# EAGLE design ReSpeaker_OPA548_V03 (EAGLE 9.2.2)
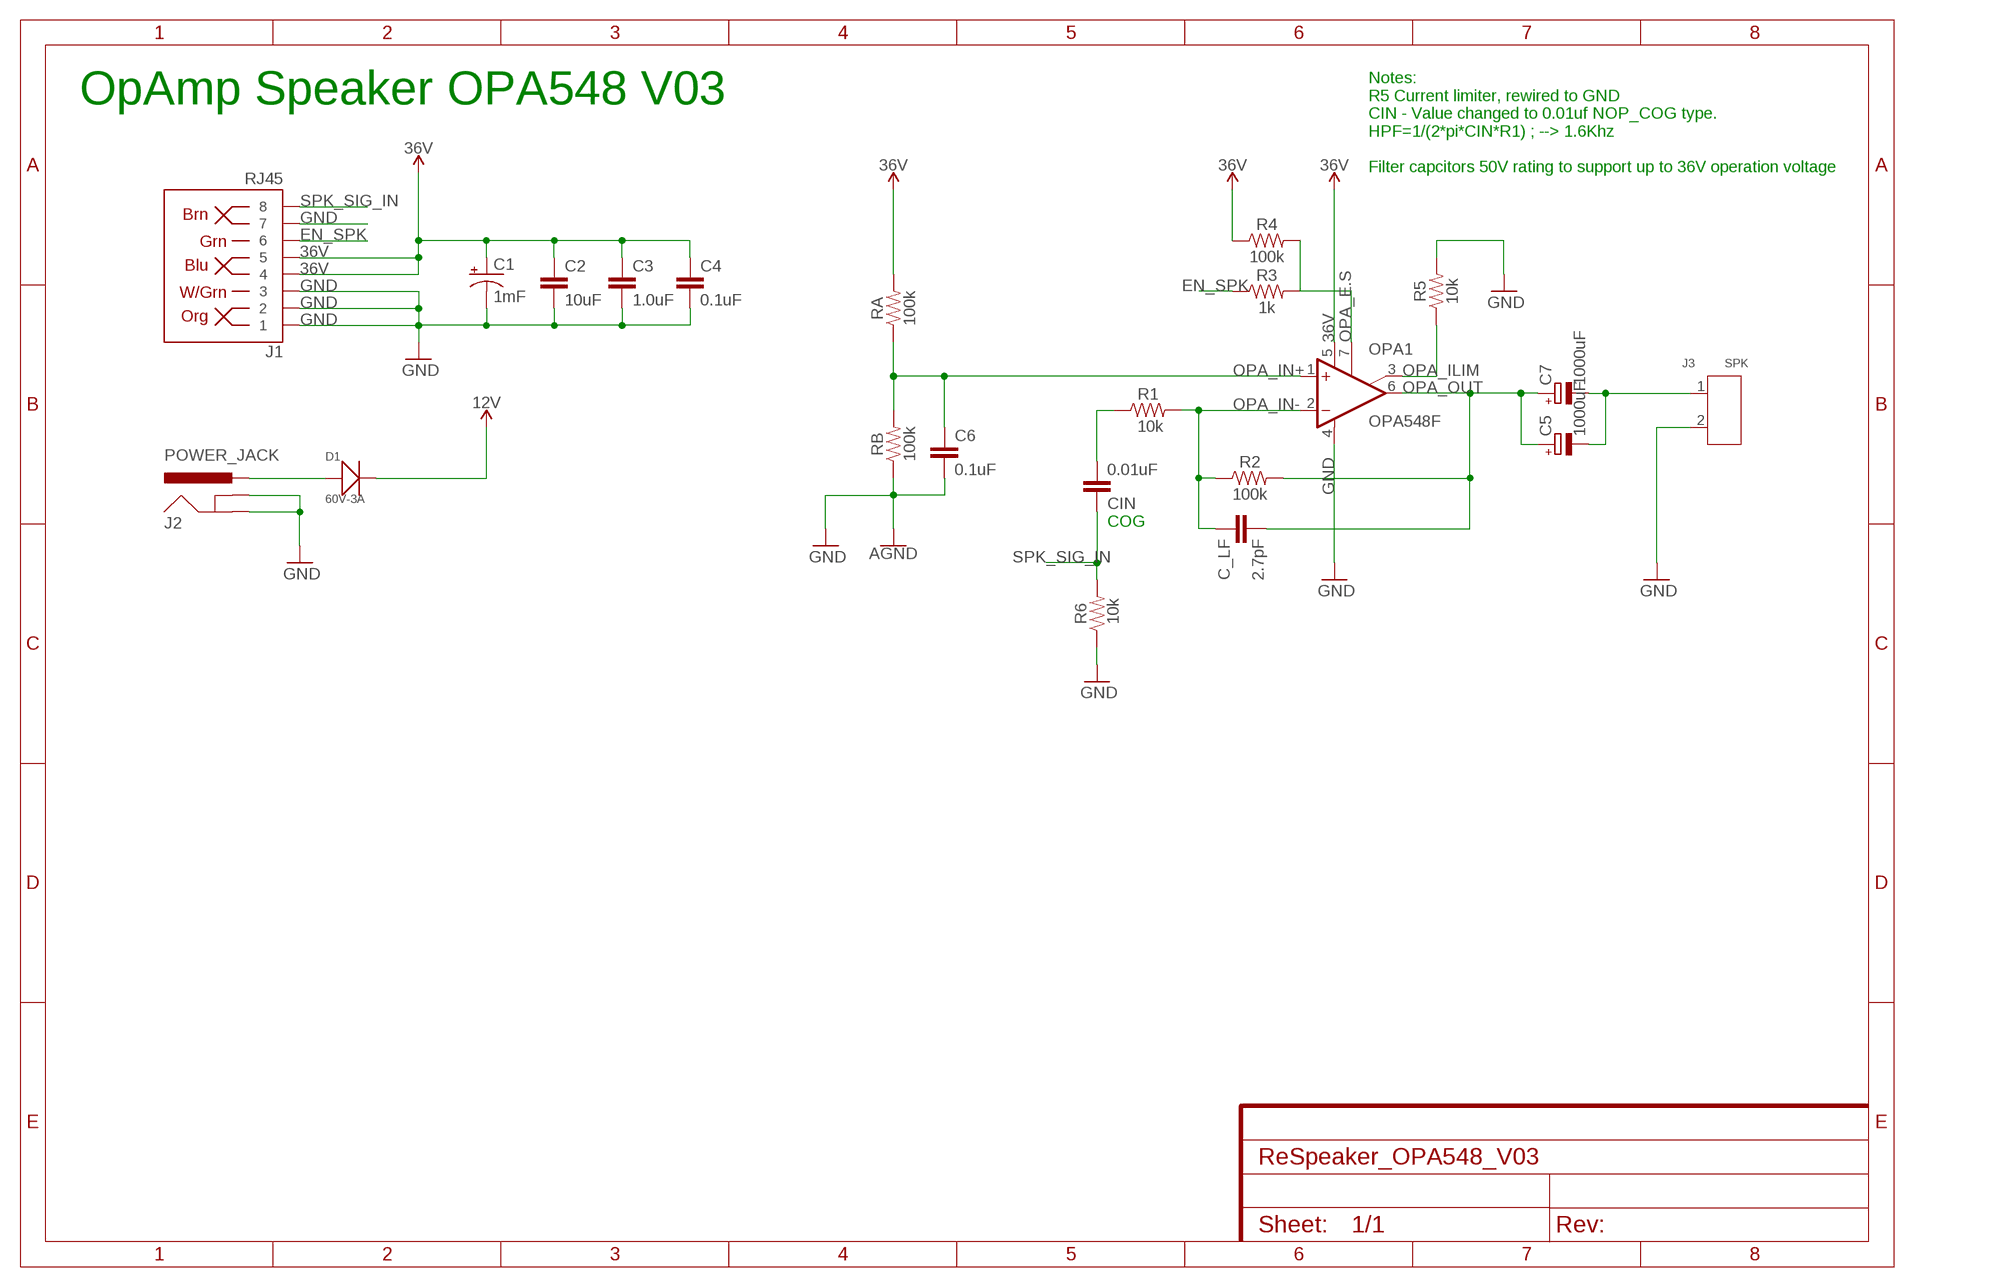
[diagram p0: schematic, sheet 1]

## Parts
C1  1mF  1000UF-RADIAL-5MM-25V-20%  [CPOL-RADIAL-5MM-10MM]
C2  10uF  10UF-0805-10V-10%  [0805]
C3  1.0uF  1.0UF-0805-25V-10%  [0805]
C4  0.1uF  1.0UF-0805-25V-10%  [0805]
C5  1000uF  CPOL-EUE7.5-16  [E7,5-16]
C6  0.1uF  1.0UF-0805-25V-10%  [0805]
C7  1000uF  CPOL-EUE7.5-16  [E7,5-16]
C_LF  2.7pF  1.0UF-0805-25V-10%  [0805]
CIN  0.01uF  1.0UF-0805-25V-10%  [0805]
D1  60V-3A  SMD-DIODE-SCHOTTKY-40V-3A(DO-214AB)  [DO-214AB]
J1  RJ45  RJ45-8  [RJ45-8]
J2  POWER_JACK  [POWER_JACK_PTH]
J3  SPK  SCREW-TERMINAL-GREEN(2P-5.0)  [H2-5.0-10.5X8.0MM]
OPA1  OPA548F  [DD-7]
R1  10k  RESISTOR0805  [0805]
R2  100k  RESISTOR0805  [0805]
R3  1k  RESISTOR0805  [0805]
R4  100k  RESISTOR0805  [0805]
R5  10k  RESISTOR0805  [0805]
R6  10k  RESISTOR0805  [0805]
RA  100k  RESISTOR0805  [0805]
RB  100k  RESISTOR0805  [0805]

## Nets
36V: C1.+ C2.1 C3.1 C4.1 D1.2(-) J1.4 J1.5 OPA1.5(V+) R4.1 RA.2 ; supply symbol labelled 12V
EN_SPK: J1.6 R3.1
GND: C1.- C2.2 C3.2 C4.2 C6.2 J1.1 J1.2 J1.3 J1.7 J2.GND J2.GNDBREAK J3.2 OPA1.4(V-) R5.2 R6.1 RB.1 ; supply symbol labelled AGND
N$1: D1.1(+) J2.PWR
N$2: C5.- C7.- J3.1
N$3: CIN.2 R1.1
OPA_E.S: OPA1.7(E/S) R3.2 R4.2
OPA_ILIM: OPA1.3(ILIM) R5.1
OPA_IN+: C6.1 OPA1.1(+IN) RA.1 RB.2
OPA_IN-: C_LF.1 OPA1.2(-IN) R1.2 R2.1
OPA_OUT: C5.+ C7.+ C_LF.2 OPA1.6(OUT) R2.2
SPK_SIG_IN: CIN.1 J1.8 R6.2

## Notes on the sheet
- OpAmp Speaker OPA548 V03
- Notes:
  R5 Current limiter, rewired to GND
  CIN - Value changed to 0.01uf NOP_COG type.
  HPF=1/(2*pi*CIN*R1) ; --> 1.6Khz
  
  Filter capcitors 50V rating to support up to 36V operation voltage
- COG

## Library data of the parts
C1 = SparkFun-Capacitors:1000UF: 1,000µF/1mF ceramic capacitors A capacitor is a passive two-terminal electrical component used to store electrical energy temporarily in an electric field. CAP-08070; PROD_ID: CAP-09538
C2 = SparkFun-Capacitors:10UF: 10.0µF ceramic capacitors A capacitor is a passive two-terminal electrical component used to store electrical energy temporarily in an electric field.; PROD_ID: CAP-11330
C3 = SparkFun-Capacitors:1.0UF: 1µF ceramic capacitors A capacitor is a passive two-terminal electrical component used to store electrical energy temporarily in an electric field.; PROD_ID: CAP-08064
C4 C6 C_LF CIN = SparkFun-Capacitors:1.0UF: 1µF ceramic capacitors A capacitor is a passive two-terminal electrical component used to store electrical energy temporarily in an electric field.; PROD_ID: CAP-08064; VALUE: 1.0uF
C5 C7 = rcl:CPOL-EU: POLARIZED CAPACITOR, European symbol; SPICEPREFIX: C
D1 = Seeed-OPL-Diode:SMD-DIODE-SCHOTTKY-40V-3A(DO-214AB): 304020018; MPN: SS34-E3/57T; VALUE: 40V-3A
J1 = SparkFun-Connectors:RJ45-8: RJ45 Jack - 8 pin Simple RJ45, 8-pin connection. Commonly used for Cat5, Cat5e, and Cat6 Ethernet cables. Here is the connector we sell at SparkFun: RJ45 8-Pin Connector <https://www.sparkfun.com/products/643> (PRT-00643) Datasheet <https://cdn.sparkfun.com/datasheets/Prototyping/04908.pdf> It is used on this SparkFun product: SparkFun RJ45 Breakout <https://www.sparkfun.com/products/716> (BOB-00716) Note, you may also be interested in the "MAGJACK" version of this. It is basically a RJ45 connector, but also has some status LEDs built into the connector housing. You can check that out in this library at the device named "MAGJACK.dev" and see these products online: RJ45 Ethernet MagJack-Compatible <https://www.sparkfun.com/products/8534> (PRT-08534) SparkFun RJ45 MagJack Breakout <https://www.sparkfun.com/products/13021> (BOB-13021); PROD_ID: CONN-08506; SF_ID: PRT-00643
J2 = SparkFun-Connectors:POWER_JACK: Power Jack Connector This is the standard 5.5mm barrel jack for power. The PTH is the most common, proven, reliable, footprint. The Slot footprint only works if the mill layer is transmitted to the PCB fab house so be warned. Here are the connectors we sell at SparkFun: DC Barrel Power Jack/Connector <https://www.sparkfun.com/products/119> (PRT-00119) DC Barrel Power Jack/Connector (SMD) <https://www.sparkfun.com/products/12748> (PRT-12748) DC Barrel Jack Adapter - Breadboard Compatible <https://www.sparkfun.com/products/10811> (PRT-10811) It is used on this SparkFun product (and many, many others): SparkFun RedBoard - Programmed with Arduino <https://www.sparkfun.com/products/12757> (DEV-12757) Also, if you need a mating power supply or connector, please check these out: Wall Adapter Power Supply - 9VDC 650mA <https://www.sparkfun.com/products/298> (TOL-00298) DC Barrel Jack Adapter - Male <https://www.sparkfun.com/products/10287> (PRT-10287); PROD_ID: CONN-08197
J3 = Seeed-OPL-Connector:SCREW-TERMINAL-GREEN(2P-5.0): 320110031; VALUE: GREEN-2P-5.0
OPA1 = burr-brown:OPA548: Operational Amplifier High-Voltage, High-Current; MPN: OPA548FKTWTG3; OC_FARNELL: 1234750; OC_NEWARK: 80K2676
R1-R6 RA RB = SparkFun-Resistors:RESISTOR: Generic Resistor Package

## Net classes
0 default: width 0.254 mm, drill 0.3 mm, clearance 0.254 mm
1 Power: width 0.305 mm, drill 0.3 mm, clearance 0.254 mm to class 0, clearance 0.254 mm

## Board
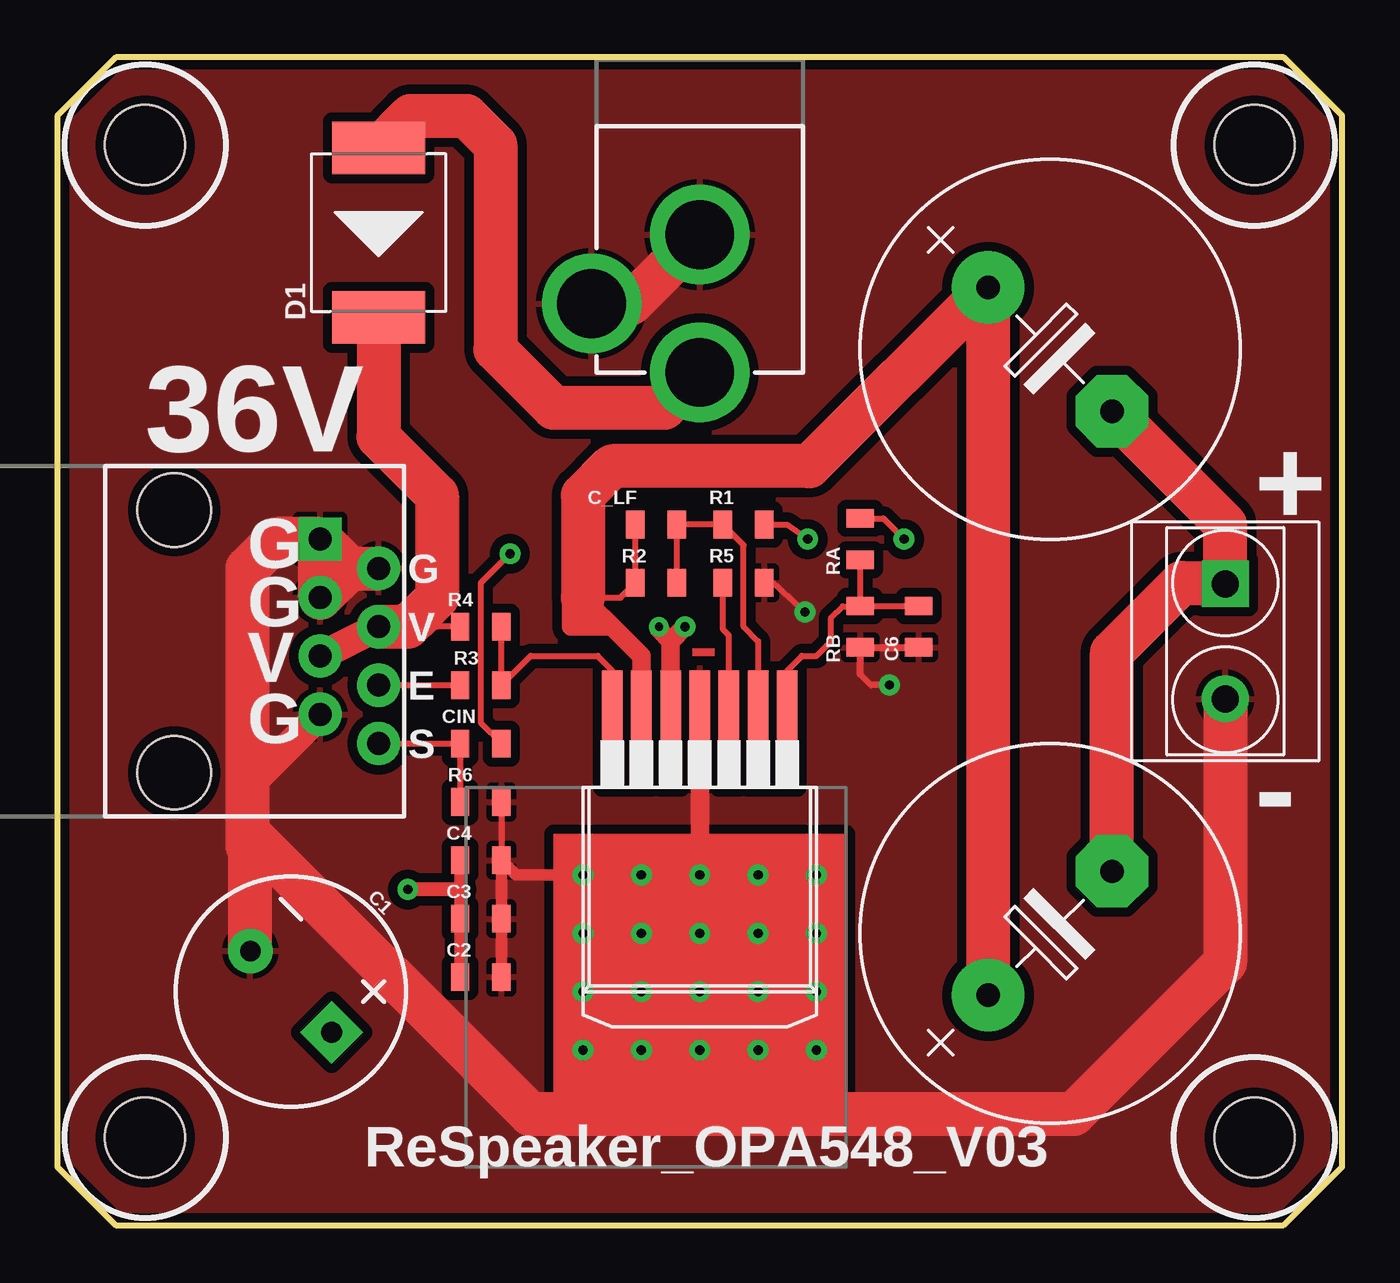
[diagram p1: board, top side]
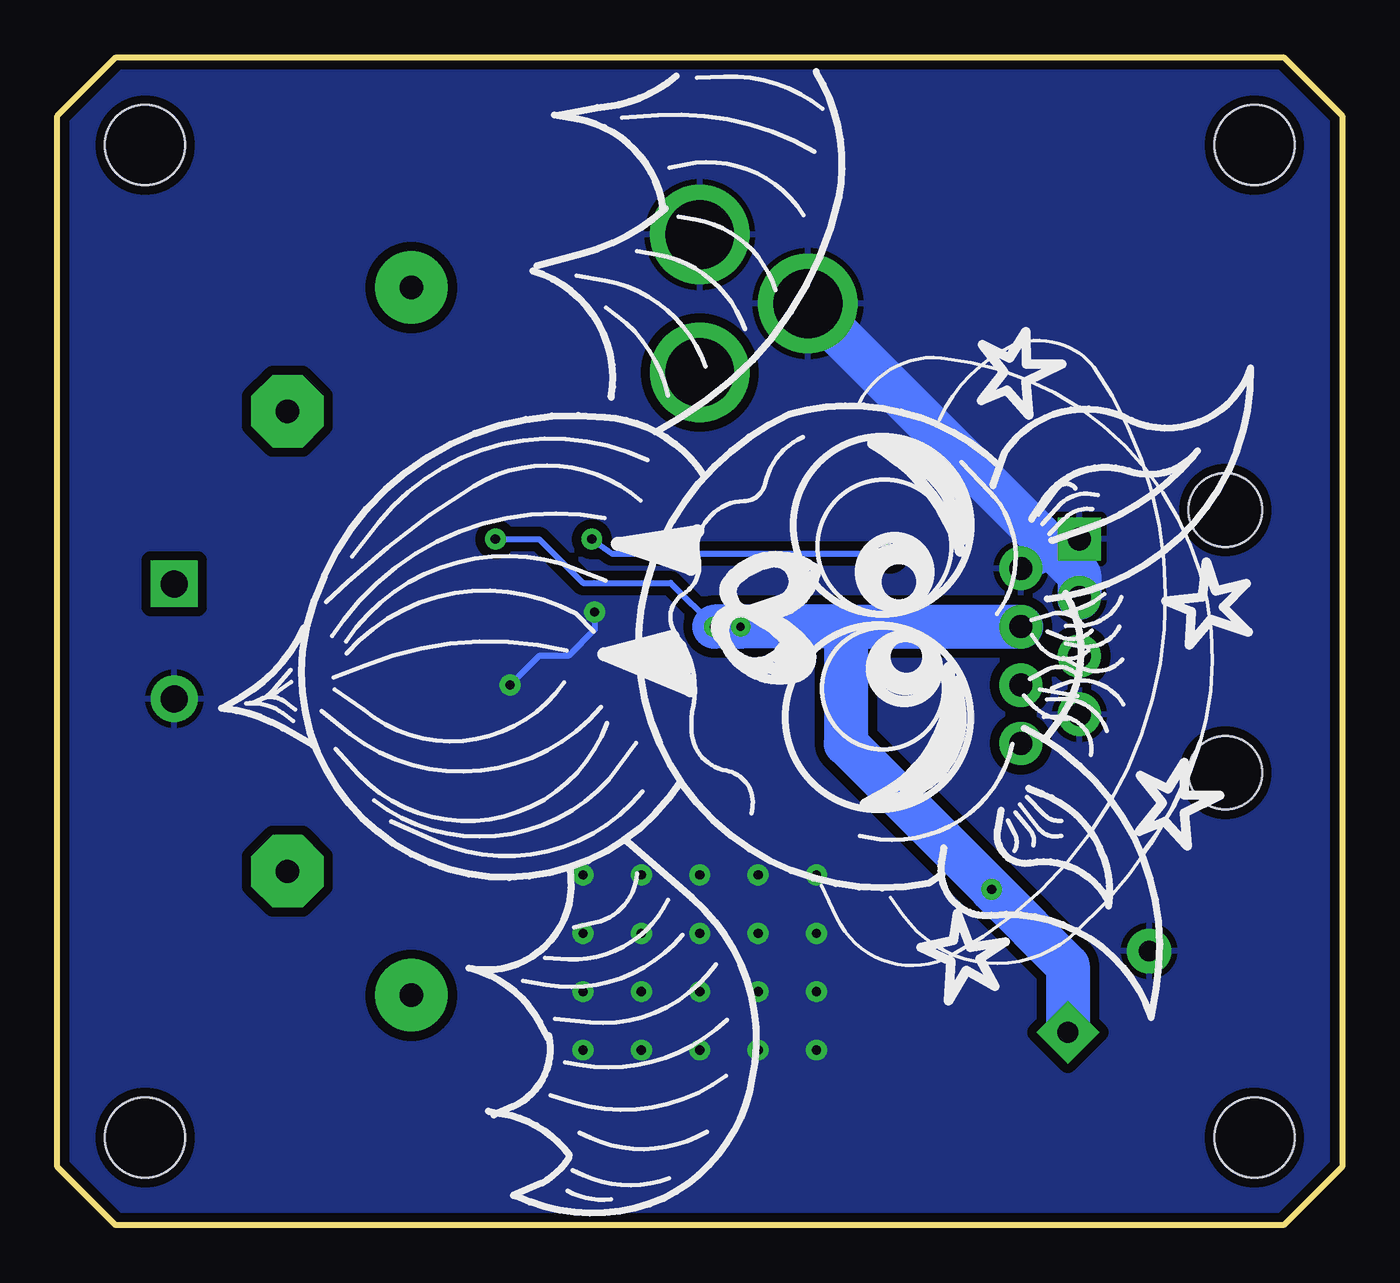
[diagram p2: board, bottom side, seen from below]

Size 55.88 x 50.8 mm. Coordinates in mm from the lower left corner, seen from the top.
Outline: 2.54,0 53.34,0 55.88,2.54 55.88,48.26 53.34,50.8 2.54,50.8 0,48.26 0,2.54 2.54,0
Copper layers (1*16): Top 0.035mm / dielectric 1.5mm / Bottom 0.035mm
Design rules "Modified-SparkFun-2-layer-STANDARD": minimum track width 10mil, minimum drill 10mil, track to track 10mil, track to pad 8mil, pad to pad 8mil, via to via 10mil, smd to smd 8mil, copper to edge 8mil, drill to drill 8mil, minimum pad ring 10mil, minimum via ring 10mil, stop-mask expansion 4mil, vias tented up to drill 25mil, thermal gap 10mil
Holes 3.5 mm at 3.81,46.99 52.07,46.99 52.07,3.81 3.81,3.81

### Footprints (pad centres in the part's own frame; a part is rotated, then mirrored left to right if it is on the bottom)
CPOL-RADIAL-5MM-10MM = drill 0.9 pad 1.93 square: + 2.5,0 | drill 0.9 pad 1.93: - -2.5,0
0805 = smd 0.8 x 1.2: 1 -0.9,0; 2 0.9,0
E7,5-16 = drill 1.016 pad 3.15: + -3.81,0 | drill 1.016 pad 3.15 octagon: - 3.81,0
DO-214AB = smd 2.286 x 4.064: 1 -3.683,0; 2 3.683,0
RJ45-8 = drill 1 pad 1.88 square: 1 -4.445,6.35 | drill 1 pad 1.88: 2 -3.175,8.89; 3 -1.905,6.35; 4 -0.635,8.89; 5 0.635,6.35; 6 1.905,8.89; 7 3.175,6.35; 8 4.445,8.89 | hole 3.2: -5.715,0; 5.715,0
POWER_JACK_PTH = drill 2.997 pad 4.318: GND 0,7.7; GNDBREAK 4.7,10.7; PWR 0,13.7
H2-5.0-10.5X8.0MM = drill 1.168 pad 2.032 square: 1 0,2.5 | drill 1.168 pad 2.032: 2 0,-2.5
DD-7 = smd 0.889 x 5.08: 1 -3.81,-6.985; 2 -2.54,-6.985; 3 -1.27,-6.985; 4 0,-6.985; 5 1.27,-6.985; 6 2.54,-6.985; 7 3.81,-6.985

### Placement (x,y rotation side)
C1  10.16,10.16 315 top
C2  18.41,10.79 0 top
C3  18.41,13.34 0 top
C4  18.41,15.88 0 top
C5  43.18,12.7 45 top
C6  37.47,26.04 270 top
C7  43.18,38.1 315 top
C_LF  26.04,30.48 180 top
CIN  18.41,20.95 0 top
D1  13.97,43.18 270 top
J1  5.08,25.4 270 top
J2  27.94,50.8 180 top
J3  50.8,25.4 0 top
OPA1  27.94,14.61 180 top
R1  29.84,30.48 180 top
R2  26.04,27.94 180 top
R3  18.41,23.5 0 top
R4  18.41,26.04 0 top
R5  29.84,27.94 0 top
R6  18.41,18.41 180 top
RA  34.92,29.84 90 top
RB  34.92,26.04 90 top

### Tracks (layer width: path | path; a pad name or v marks a point on that pad's centre or on a via)
36V  (via drill 0.35, 0.4)
  Top 0.254: R4.1 16.51,26.04 15.88,26.67 | RA.2 35.93,30.75 v36.83,29.84
  Top 0.508: C2.1 C3.1 17.52,14.61 C4.1
  Top 0.61: 17.52,14.61 v15.24,14.61
  Top 0.813: 26.67,25.4 v27.3,26.04 | 26.67,25.4 26.16,25.91 v26.16,26.04 | 26.67,25.4 OPA1.5
  Top 1.27: J1.5 J1.4
  Top 1.905: J1.4 15.24,26.04 15.88,26.67 16.51,27.3 16.51,31.75 13.97,34.29 D1.2
  Bottom 0.254: v36.83,29.84 34.92,29.84 33.02,27.94 29.21,27.94 v27.3,26.04
  Bottom 1.905: 21.59,26.04 J1.4 | 21.59,26.04 v26.16,26.04 v27.3,26.04 | 21.59,26.04 21.59,20.95 v15.24,14.61 11.93,11.29 C1.+
EN_SPK
  Top 0.254: J1.6 R3.1
GND  (via drill 0.4)
  Top 0.254: R5.2 31.11,27.94 v32.51,26.67 | v36.2,23.5 35.39,23.5 34.92,23.96 | R6.1 C4.2
  Top 0.305: 34.92,23.96 RB.1 C6.2
  Top 0.508: C2.2 C3.2 C4.2 19.95,15.24 v22.86,15.24
  Top 0.813: v27.94,15.24 OPA1.4
  Top 1.27: J1.7 8.26,19.05
  Top 1.905: 12.7,28.57 J1.2 | 12.7,28.57 J1.3 J1.1 | J1.1 12.7,28.57 | J1.1 9.53,29.84 8.26,28.57 8.26,19.05 8.26,16.51 8.39,16.37 | 27.94,4.83 44.2,4.83 50.8,11.43 J3.2 | 27.94,4.83 20.57,4.83 8.39,17.01 8.39,16.37 | C1.- 8.39,16.37 | J2.GNDBREAK 24.94,40.1 J2.GND | v27.94,15.24 v27.94,7.62 27.94,4.83
  Bottom 0.254: v32.51,26.67 32.51,25.91 33.66,24.77 34.92,24.77 v36.2,23.5
  Bottom 1.27: J1.2 J1.1
  Bottom 1.905: J2.GNDBREAK 11.43,28.29 J1.3
  other vias: 25.4,10.16 25.4,15.24 25.4,12.7 27.94,12.7 30.48,12.7 30.48,7.62 27.94,10.16 30.48,15.24 30.48,10.16 25.4,7.62 22.86,12.7 22.86,10.16 22.86,7.62 33.02,7.62 33.02,10.16 33.02,12.7 33.02,15.24
  pour Top (isolate 0.406): 0,0 55.88,0 55.88,50.8 0,50.8
  pour Bottom (isolate 0.406): 0,0 55.88,0 55.88,50.8 0,50.8
N$1
  Top 1.905: D1.1 15.37,48.26 17.78,48.26 19.05,46.99 19.05,38.1 21.59,35.56 26.4,35.56 J2.PWR
N$2
  Top 1.905: C7.- 50.8,30.48 J3.1 50.76,27.94 48.9,27.94 45.87,24.92 C5.-
N$3  (via drill 0.4)
  Top 0.254: R1.1 31.75,30.48 v32.64,29.84 | v19.68,29.21 18.41,27.94 18.41,21.86 CIN.2
  Bottom 0.254: v32.64,29.84 31.75,29.21 v19.68,29.21
OPA_E.S
  Top 0.254: R4.2 R3.2 20.59,24.77 23.5,24.77 24.13,24.13 OPA1.7
OPA_ILIM
  Top 0.254: OPA1.3 29.21,25.65 28.96,25.91 28.96,27.93 R5.1
OPA_IN+
  Top 0.254: RB.2 RA.1 | RB.2 C6.1 | RB.2 34.16,26.92 33.66,26.42 33.66,25.4 33.02,24.77 32.38,24.77 31.75,24.13 OPA1.1
OPA_IN-
  Top 0.254: R2.1 C_LF.1 R1.2 29.84,29.58 29.84,26.04 30.48,25.4 OPA1.2
OPA_OUT
  Top 0.254: 22.86,27.3 24.5,27.3 R2.2 C_LF.2
  Top 0.813: 24.13,26.04 25.4,24.77 OPA1.6 | 23.24,26.92 22.86,27.3 | 24.13,26.04 22.35,26.04 22.35,26.92 23.24,26.92 | 23.24,26.92 24.13,26.04
  Top 1.905: 22.86,27.3 22.86,31.75 24.13,33.02 32.71,33.02 C7.+ C5.+
SPK_SIG_IN
  Top 0.254: J1.8 CIN.1 R6.2
(copper drawn outside any net)
  shapes: Top area x1

### Text on the board
tPlace: 36V | + | G | G | G | V | V | E | G | S | - | ReSpeaker_OPA548_V03